# EAGLE design bike_tracker (EAGLE 9.2.1)
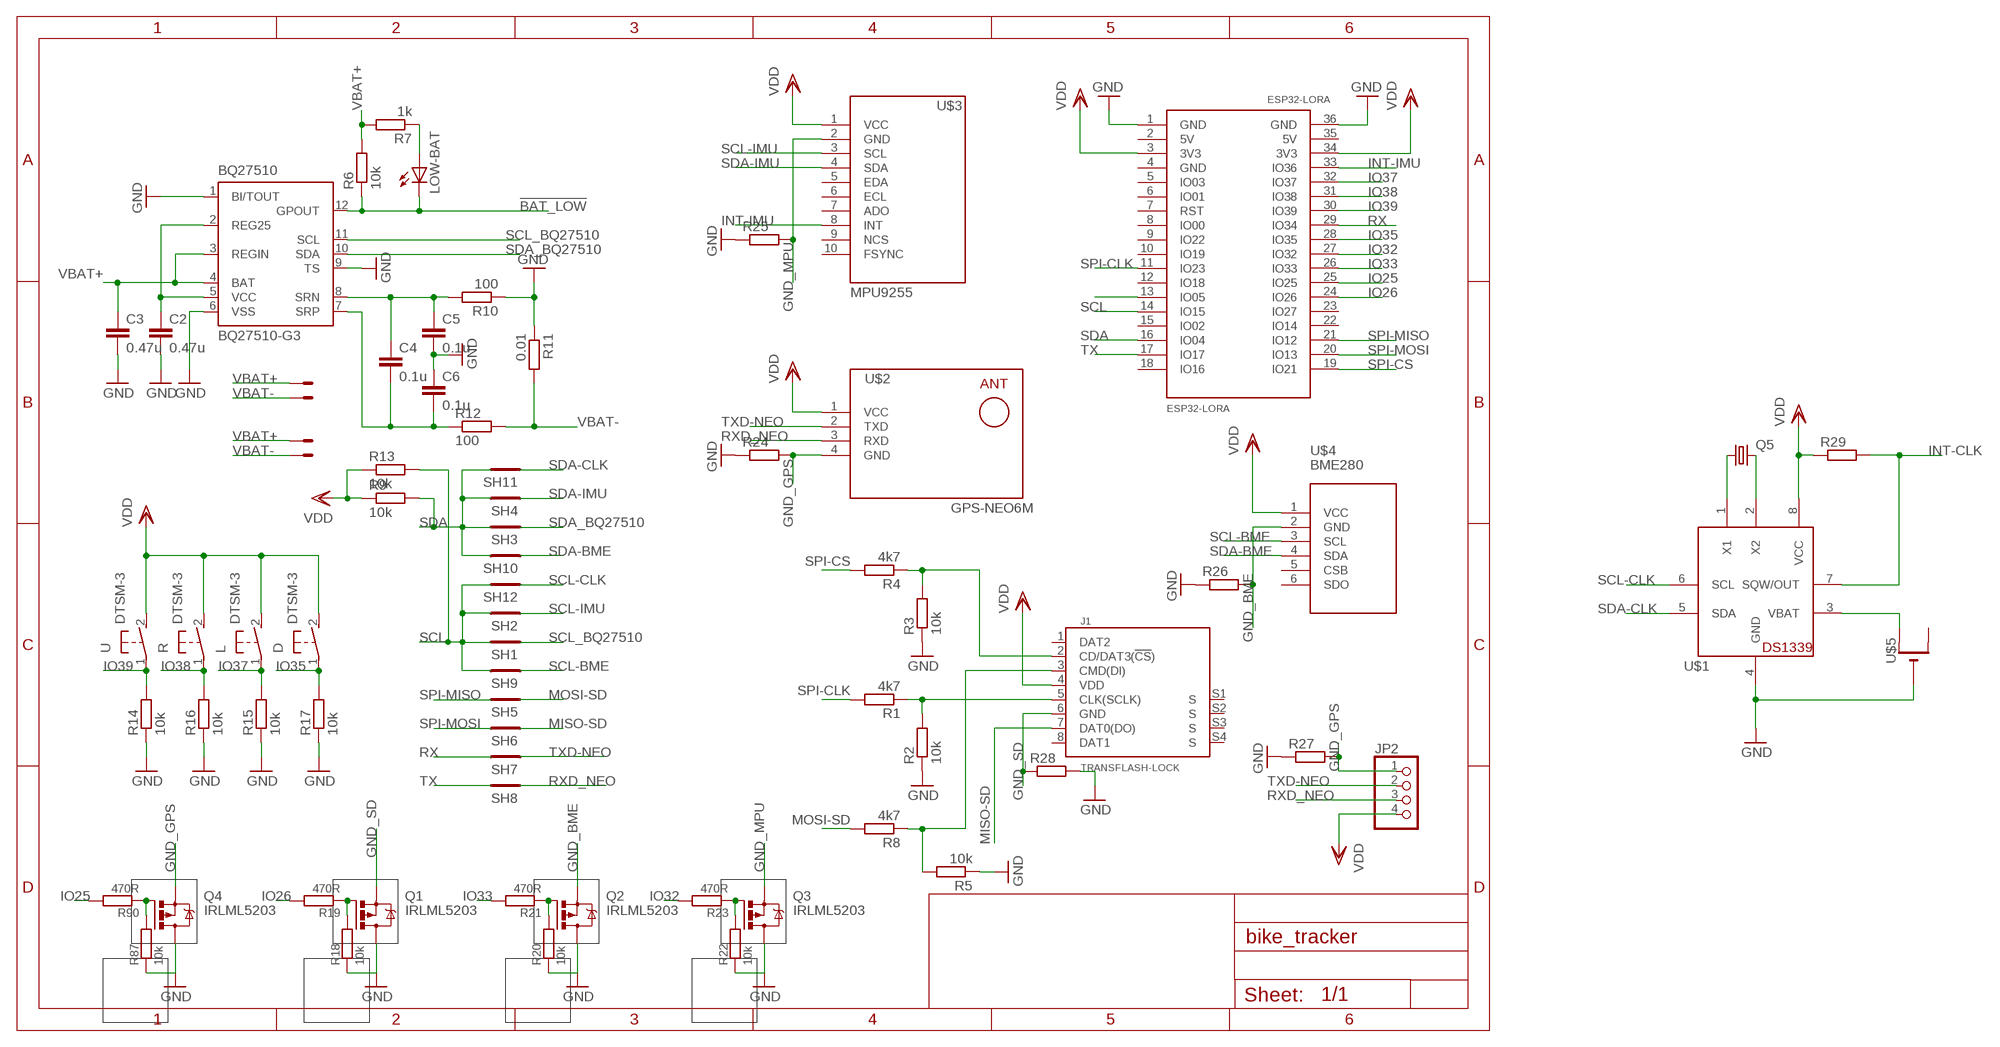
[diagram p0: schematic, sheet 1]

## Parts
BAT  332-02  [332-02]
BAT-IN  332-02  [332-02]
BQ27510  BQ27510-G3  [DRZ]
C2  0.47u  C-EUC0603  [C0603]
C3  0.47u  C-EUC0603  [C0603]
C4  0.1u  C-EUC0603  [C0603]
C5  0.1u  C-EUC0603  [C0603]
C6  0.1u  C-EUC0603  [C0603]
D  DTSM-3  [DTSM-3]
ESP32-LORA  ESP32LORA  [ESP32-LORA-TTGO]
J1  TRANSFLASH-LOCK  [TRANSFLASH-LOCK-SOCK]
JP2  PINHD-1X4  [1X04]
L  DTSM-3  [DTSM-3]
LOW-BAT  LEDSML0805  [SML0805]
Q1  IRLML5203  [MICRO3]
Q2  IRLML5203  [MICRO3]
Q3  IRLML5203  [MICRO3]
Q4  IRLML5203  [MICRO3]
Q5  CRYSTALTC26H  [TC26H]
R  DTSM-3  [DTSM-3]
R1  4k7  R-EU_R0603  [R0603]
R2  10k  R-EU_R0603  [R0603]
R3  10k  R-EU_R0603  [R0603]
R4  4k7  R-EU_R0603  [R0603]
R5  10k  R-EU_R0603  [R0603]
R6  10k  R-EU_R0603  [R0603]
R7  1k  R-EU_R0603  [R0603]
R8  4k7  R-EU_R0603  [R0603]
R9  10k  R-EU_R0603  [R0603]
R10  100  R-EU_R0603  [R0603]
R11  0.01  R-EU_R0603  [R0603]
R12  100  R-EU_R0603  [R0603]
R13  10k  R-EU_R0603  [R0603]
R14  10k  R-EU_R0603  [R0603]
R15  10k  R-EU_R0603  [R0603]
R16  10k  R-EU_R0603  [R0603]
R17  10k  R-EU_R0603  [R0603]
R18  10k  R_SMDR0603  [0603]
R19  470R  R_SMDR0603  [0603]
R20  10k  R_SMDR0603  [0603]
R21  470R  R_SMDR0603  [0603]
R22  10k  R_SMDR0603  [0603]
R23  470R  R_SMDR0603  [0603]
R24  R-EU_R0201  [R0201]
R25  R-EU_R0201  [R0201]
R26  R-EU_R0201  [R0201]
R27  R-EU_R0201  [R0201]
R28  R-EU_R0201  [R0201]
R29  R-EU_R0603  [R0603]
R87  10k  R_SMDR0603  [0603]
R90  470R  R_SMDR0603  [0603]
SH1  SHORT  [SHORT_TOP-20]
SH2  SHORT  [SHORT_TOP-20]
SH3  SHORT  [SHORT_TOP-20]
SH4  SHORT  [SHORT_TOP-20]
SH5  SHORT  [SHORT_TOP-20]
SH6  SHORT  [SHORT_TOP-20]
SH7  SHORT  [SHORT_TOP-20]
SH8  SHORT  [SHORT_TOP-20]
SH9  SHORT  [SHORT_TOP-20]
SH10  SHORT  [SHORT_TOP-20]
SH11  SHORT  [SHORT_TOP-20]
SH12  SHORT  [SHORT_TOP-20]
U  DTSM-3  [DTSM-3]
U$1  DS1339  [SOPM08]
U$2  GPS-NEO6M  [GPS-RECEIVER-NEO6M2]
U$3  MPU9255  [MPU9255]
U$4  BME280  [BME280]
U$5  CR1220SMT  [CR1220-SMD]

## Nets
!BAT_LOW: BQ27510.12(GPOUT) LOW-BAT.C R6.1
GND [Ground]: BQ27510.1(BI/TOUT) BQ27510.6(VSS) BQ27510.9(TS) C2.2 C3.2 C5.2 C6.1 ESP32-LORA.1(GND) ESP32-LORA.36(GND) Q1.3(D) Q2.3(D) Q3.3(D) Q4.3(D) R2.1 R3.1 R5.1 R10.1 R11.1 R14.1 R15.1 R16.1 R17.1 R18.1 R20.1 R22.1 R24.1 R25.1 R26.1 R27.1 R28.2 R87.1 U$1.4(GND) U$5.-
GND_BME [Ground]: Q2.2(S) R26.2 U$4.2(GND)
GND_GPS [Ground]: JP2.1 Q4.2(S) R24.2 R27.2 U$2.4(GND)
GND_MPU [Ground]: Q3.2(S) R25.2 U$3.2(GND)
GND_SD [Ground]: J1.6(GND) Q1.2(S) R28.1
INT-CLK: R29.2 U$1.7(SQW/OUT)
INT-IMU: ESP32-LORA.33(IO36) U$3.8(INT)
IO25: ESP32-LORA.25(IO25) R90.2
IO26: ESP32-LORA.24(IO26) R19.2
IO32: ESP32-LORA.27(IO32) R23.2
IO33: ESP32-LORA.26(IO33) R21.2
IO35: D.1 ESP32-LORA.28(IO35) R17.2
IO37: ESP32-LORA.32(IO37) L.1 R15.2
IO38: ESP32-LORA.31(IO38) R16.2 R.1
IO39: ESP32-LORA.30(IO39) R14.2 U.1
MISO-SD: J1.7(DAT0(DO)) SH6.1
MOSI-SD: R8.2 SH5.1
N$1: J1.5(CLK(SCLK)) R1.1 R2.2
N$2: J1.2(CD/DAT3(!CS!)) R3.2 R4.1
N$3: J1.3(CMD(DI)) R5.2 R8.1
N$4: Q4.1(G) R87.2 R90.1
N$5: Q1.1(G) R18.2 R19.1
N$6: Q2.1(G) R20.2 R21.1
N$7: BQ27510.2(REG25) BQ27510.5(VCC) C2.1
N$8: Q3.1(G) R22.2 R23.1
N$9: LOW-BAT.A R7.1
N$10: Q5.1 U$1.1(X1)
N$11: BQ27510.8(SRN) C4.1 C5.1 R10.2
N$12: ESP32-LORA.13(IO05)
N$13: Q5.2 U$1.2(X2)
N$14: BQ27510.7(SRP) C4.2 C6.2 R12.1
N$15: U$1.3(VBAT) U$5.+$1(+)
RX: ESP32-LORA.29(IO34) SH7.2
RXD_NEO: JP2.3 SH8.1 U$2.3(RXD)
SCL: ESP32-LORA.14(IO15) R13.2 SH1.2 SH2.2 SH9.2 SH12.2
SCL-BME: SH9.1 U$4.3(SCL)
SCL-CLK: SH12.1 U$1.6(SCL)
SCL-IMU: SH2.1 U$3.3(SCL)
SCL_BQ27510: BQ27510.11(SCL) SH1.1
SDA: ESP32-LORA.16(IO04) R9.2 SH3.2 SH4.2 SH10.2 SH11.2
SDA-BME: SH10.1 U$4.4(SDA)
SDA-CLK: SH11.1 U$1.5(SDA)
SDA-IMU: SH4.1 U$3.4(SDA)
SDA_BQ27510: BQ27510.10(SDA) SH3.1
SPI-CLK: ESP32-LORA.11(IO23) R1.2
SPI-CS: ESP32-LORA.19(IO21) R4.2
SPI-MISO: ESP32-LORA.21(IO12) SH5.2
SPI-MOSI: ESP32-LORA.20(IO13) SH6.2
TX: ESP32-LORA.17(IO17) SH8.2
TXD-NEO: JP2.2 SH7.1 U$2.2(TXD)
VBAT+: BAT-IN.2 BAT.1 BQ27510.3(REGIN) BQ27510.4(BAT) C3.1 R6.2 R7.2
VBAT-: BAT-IN.1 BAT.2 R11.2 R12.2
VDD: D.2 ESP32-LORA.3(3V3) ESP32-LORA.34(3V3) J1.4(VDD) JP2.4 L.2 R9.1 R13.1 R29.1 R.2 U$1.8(VCC) U$2.1(VCC) U$3.1(VCC) U$4.1(VCC) U.2
Unconnected: ESP32-LORA.5(IO03) ESP32-LORA.6(IO01) ESP32-LORA.7(RST) ESP32-LORA.8(IO00) ESP32-LORA.9(IO22) ESP32-LORA.10(IO19) ESP32-LORA.12(IO18) ESP32-LORA.15(IO02) ESP32-LORA.18(IO16) ESP32-LORA.22(IO14) ESP32-LORA.23(IO27) J1.1(DAT2) J1.8(DAT1) J1.S1(S) J1.S2(S) J1.S3(S) J1.S4(S) U$3.5(EDA) U$3.6(ECL) U$3.7(ADO) U$3.9(NCS) U$3.10(FSYNC) U$4.5(CSB) U$4.6(SDO) U$5.+$2(+1)

## Power pins joined to a net without a drawn wire
5V: ESP32-LORA.2(5V) ESP32-LORA.35(5V)
GND: ESP32-LORA.4(GND)
PWPD: BQ27510.EXP@1(PWPD) BQ27510.EXP@2(PWPD) BQ27510.EXP@3(PWPD) BQ27510.EXP@4(PWPD) BQ27510.EXP@5(PWPD) BQ27510.EXP@6(PWPD) BQ27510.EXP@7(PWPD) BQ27510.EXP@8(PWPD) BQ27510.EXP@9(PWPD)

## Library data of the parts
BAT BAT-IN = con-garry:332-02: 2 Pin - 2mm Dual Row Source: www.mpe-connector.de / garry_shortform_2012.pdf
BQ27510 = texas:BQ27510-G3
C2-C6 = rcl:C-EU: CAPACITOR, European symbol
D L R U = switch-tact:DTSM-3
ESP32-LORA = ESP32-DEVKITC:ESP32LORA
J1 = sd-mmc:TRANSFLASH: TransFlash TF Micro SD Card Socket Adapter
JP2 = pinhead:PINHD-1X4: PIN HEADER
LOW-BAT = led:LED: LED OSRAM: - CHIPLED LG R971, LG N971, LY N971, LG Q971, LY Q971, LO R971, LY R971 LH N974, LH R974 LS Q976, LO Q976, LY Q976 LO Q996 - Hyper CHIPLED LW Q18S LB Q993, LB Q99A, LB R99A - SideLED LS A670, LO A670, LY A670, LG A670, LP A670 LB A673, LV A673, LT A673, LW A673 LH A674 LY A675 LS A676, LA A676, LO A676, LY A676, LW A676 LS A679, LY A679, LG A679 - Hyper Micro SIDELED® LS Y876, LA Y876, LO Y876, LY Y876 LT Y87S - SmartLED LW L88C, LW L88S LB L89C, LB L89S, LG L890 LS L89K, LO L89K, LY L89K LS L896, LA L896, LO L896, LY L896 - TOPLED LS T670, LO T670, LY T670, LG T670, LP T670 LSG T670, LSP T670, LSY T670, LOP T670, LYG T670 LG T671, LOG T671, LSG T671 LB T673, LV T673, LT T673, LW T673 LH T674 LS T676, LA T676, LO T676, LY T676, LB T676, LH T676, LSB T676, LW T676 LB T67C, LV T67C, LT T67C, LS T67K, LO T67K, LY T67K, LW E67C LS E67B, LA E67B, LO E67B, LY E67B, LB E67C, LV E67C, LT E67C LW T67C LS T679, LY T679, LG T679 LS T770, LO T770, LY T770, LG T770, LP T770 LB T773, LV T773, LT T773, LW T773 LH T774 LS E675, LA E675, LY E675, LS T675 LS T776, LA T776, LO T776, LY T776, LB T776 LHGB T686 LT T68C, LB T68C - Hyper Mini TOPLED® LB M676 - Mini TOPLED Santana® LG M470 LS M47K, LO M47K, LY M47K Source: http://www.osram.convergy.de LUXEON: - LUMILED® LXK2-PW12-R00, LXK2-PW12-S00, LXK2-PW14-U00, LXK2-PW14-V00 LXK2-PM12-R00, LXK2-PM12-S00, LXK2-PM14-U00 LXK2-PE12-Q00, LXK2-PE12-R00, LXK2-PE12-S00, LXK2-PE14-T00, LXK2-PE14-U00 LXK2-PB12-K00, LXK2-PB12-L00, LXK2-PB12-M00, LXK2-PB14-N00, LXK2-PB14-P00, LXK2-PB14-Q00 LXK2-PR12-L00, LXK2-PR12-M00, LXK2-PR14-Q00, LXK2-PR14-R00 LXK2-PD12-Q00, LXK2-PD12-R00, LXK2-PD12-S00 LXK2-PH12-R00, LXK2-PH12-S00 LXK2-PL12-P00, LXK2-PL12-Q00, LXK2-PL12-R00 Source: www.luxeon.com KINGBRIGHT: KA-3528ASYC Source: www.kingbright.com
Q1-Q4 = transistor-power:IRLML5203: HEXFET P-Channel Power MOSFET
Q5 = adafruit:CRYSTAL: CRYSTAL; OC_FARNELL: unknown; OC_NEWARK: unknown
R1-R17 R24-R29 = resistor:R-EU_: RESISTOR, European symbol
R18-R23 R87 R90 = ssmd:R_SMD
SH1-SH12 = shorts:SHORT: Short between two nets
U$1 = adafruit:DS1339
U$2 = diy-modules:GPS-NEO6M
U$3 = diy-modules:MPU9255
U$4 = diy-modules:BME280
U$5 = adafruit:CR1220: CR1216/CR1220/CR1225 12mm 3V lithium coin cell Great for battery packup. Both SMT and THM holders. Note the THM package has the ground pads on both sides of the PCB so that the masks are the same - this reduces the cost

## Net classes
0 default: width 0.254 mm
1 Ground: width 0.1 mm, drill 0.2 mm

## Board
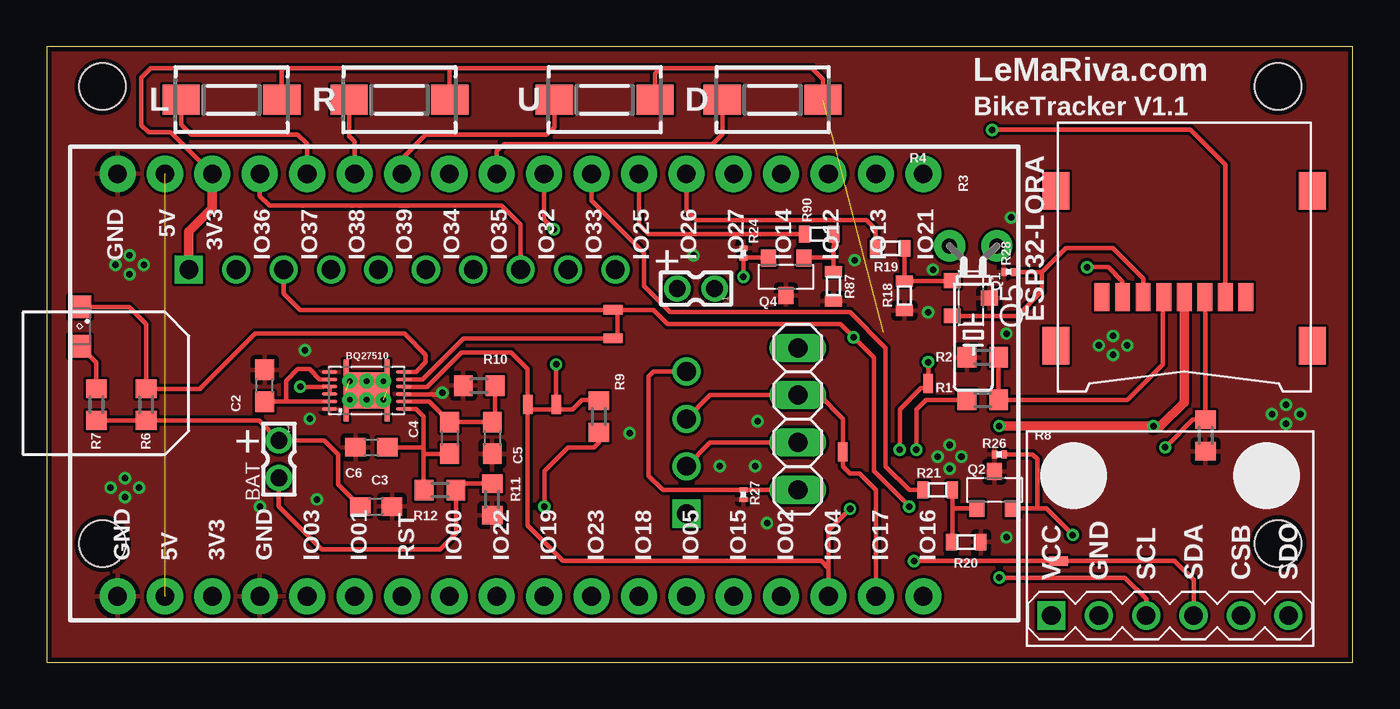
[diagram p1: board, top side]
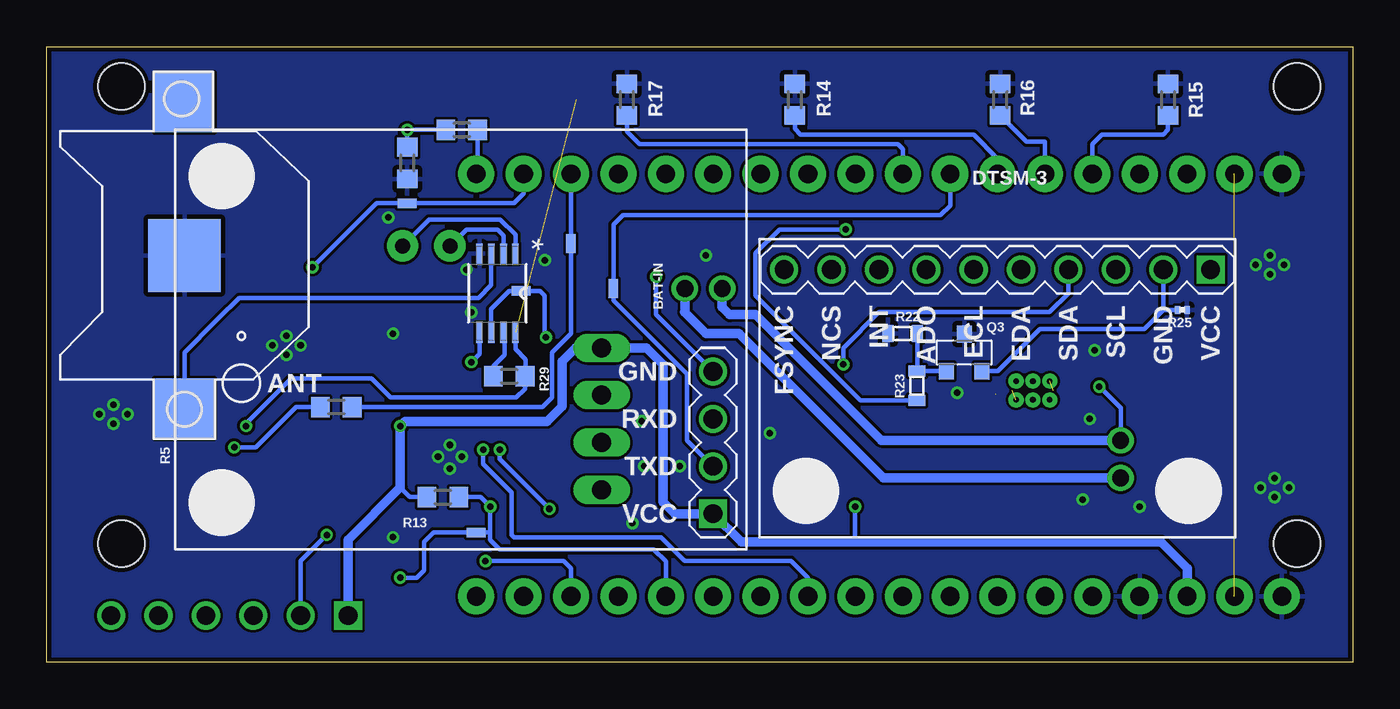
[diagram p2: board, bottom side, seen from below]

Size 70 x 33 mm. Coordinates in mm from the lower left corner, seen from the top.
Outline: 0,0 70,0 70,33 0,33 0,0
Copper layers (1*16): Top 0.035mm / dielectric 1.5mm / Bottom 0.035mm
Design rules "SeeedStudio_2layer_DRU_no_angle_20140221": minimum track width 6mil, minimum drill 12mil, track to track 6mil, track to pad 6mil, pad to pad 6mil, via to via 6mil, smd to smd 0mil, copper to edge 10mil, drill to drill 10mil, minimum pad ring 10mil, minimum via ring 6mil, stop-mask expansion 2mil, vias tented up to drill 100mil, thermal gap 10mil
Holes 2.5 mm at 3,30.85 66,6.35 3,6.35 66,30.85

### Footprints (pad centres in the part's own frame; a part is rotated, then mirrored left to right if it is on the bottom)
332-02 = drill 0.9 pad 1.27: 1 0,-1; 2 0,1
DRZ = smd 0.85 x 0.2: 1 -1.975,1; 2 -1.975,0.6; 3 -1.975,0.2; 4 -1.975,-0.2; 5 -1.975,-0.6; 6 -1.975,-1; 7 1.975,-1; 8 1.975,-0.6; 9 1.975,-0.2; 10 1.975,0.2; 11 1.975,0.6; 12 1.975,1 | smd 2.45 x 1.95: EXP@1 0,0 | smd 0.25 x 3.3: EXP@2 -1.1,0; EXP@3 1.1,0 | drill 0.3 pad 0.406: EXP@4 -0.9,0.5; EXP@5 0,0.5; EXP@6 0.9,0.5; EXP@7 -0.9,-0.5; EXP@8 0,-0.5; EXP@9 0.9,-0.5
C0603 = smd 1.1 x 1: 1 -0.85,0; 2 0.85,0
DTSM-3 = smd 2 x 1.6: 1 -2.7,0; 2 2.7,0
ESP32-LORA-TTGO = drill 1 pad 1.93: 1 -21.6,-11.42; 2 -19.06,-11.42; 3 -16.52,-11.42; 4 -13.98,-11.42; 5 -11.44,-11.42; 6 -8.9,-11.42; 7 -6.36,-11.42; 8 -3.82,-11.42; 9 -1.28,-11.42; 10 1.26,-11.42; 11 3.8,-11.42; 12 6.34,-11.42; 13 8.88,-11.42; 14 11.42,-11.42; 15 13.96,-11.42; 16 16.5,-11.42; 17 19.04,-11.42; 18 21.58,-11.42; 19 21.58,11.23; 20 19.04,11.23; 21 16.5,11.23; 22 13.96,11.23; 23 11.42,11.23; 24 8.88,11.23; 25 6.34,11.23; 26 3.8,11.23; 27 1.26,11.23; 28 -1.28,11.23; 29 -3.82,11.23; 30 -6.36,11.23; 31 -8.9,11.23; 32 -11.44,11.23; 33 -13.98,11.23; 34 -16.52,11.23; 35 -19.06,11.23; 36 -21.6,11.23
TRANSFLASH-LOCK-SOCK = smd 0.8 x 1.5: 1 3.3,-0.46; 2 2.2,-0.46; 3 1.1,-0.46; 4 0,-0.46; 5 -1.1,-0.46; 6 -2.2,-0.46; 7 -3.3,-0.46; 8 -4.4,-0.46 | smd 1.45 x 2: S1 -6.875,-3.06; S2 -6.875,5.24; S3 6.875,5.24; S4 6.875,-3.06
1X04 = drill 1.016 long: 1 -3.81,0; 2 -1.27,0; 3 1.27,0; 4 3.81,0
SML0805 = smd 1.2 x 1.2: A 1.05,0; C -1.05,0
MICRO3 = smd 0.8 x 0.9: 1 -0.95,-1; 2 0.95,-1; 3 0,1
TC26H = drill 0.813 pad 1.676: 1 -1.27,0; 2 1.27,0
R0603 = smd 1 x 1.1: 1 -0.85,0; 2 0.85,0
0603 = smd 0.6 x 0.9: 1 -0.787,0; 2 0.787,0
R0201 = smd 0.28 x 0.43: 1 -0.255,0; 2 0.255,0
SHORT_TOP-20 = smd 0.508 x 0.508: 1 0.381,0; 2 -0.127,0
SOPM08 = smd 1.067 x 0.356: 1 -2.134,0.965; 2 -2.134,0.33; 3 -2.134,-0.33; 4 -2.134,-0.965; 5 2.134,-0.965; 6 2.134,-0.33; 7 2.134,0.33; 8 2.134,0.965
GPS-RECEIVER-NEO6M2 = drill 1 square: 1 -14.605,10.16 | drill 1: 2 -14.605,7.62; 3 -14.605,5.08; 4 -14.605,2.54
MPU9255 = drill 1 square: 1 -8.001,10.16 | drill 1: 2 -8.001,7.62; 3 -8.001,5.08; 4 -8.001,2.54; 5 -8.001,0; 6 -8.001,-2.54; 7 -8.001,-5.08; 8 -8.001,-7.62; 9 -8.001,-10.16; 10 -8.001,-12.7
BME280 = drill 1 square: 1 -8.001,10.16 | drill 1: 2 -8.001,7.62; 3 -8.001,5.08; 4 -8.001,2.54; 5 -8.001,0; 6 -8.001,-2.54
CR1220-SMD = smd 3.2 x 3.2: +$1 -8.2,0; +$2 8.2,0 | smd 3.9 x 3.9: - 0,0

### Placement (x,y rotation side)
BAT  12.45,10.89 180 top
BAT-IN  34.8,20.03 90 top
BQ27510  17.15,14.57 0 top
C2  11.68,14.82 90 top
C3  17.65,8.35 0 top
C4  21.59,12.03 270 top
C5  23.88,12.03 270 top
C6  17.4,11.52 0 top
D  38.91,30.15 0 top
ESP32-LORA  25.4,14.95 0 top
J1  60.96,20.03 0 top
JP2  40.26,13.04 90 top
L  9.91,30.15 0 top
LOW-BAT  1.78,18 270 top
Q1  49.53,19.52 270 top
Q2  50.8,9.23 0 top
Q3  20.83,16.6 0 bottom
Q4  39.62,20.66 180 top
Q5  49.66,22.32 180 top
R  18.91,30.15 0 top
R1  50.16,14.06 180 top
R2  50.16,16.35 0 top
R3  50.67,26.76 90 bottom
R4  47.75,28.54 0 bottom
R5  62.1,12.16 90 top
R6  5.33,13.81 270 top
R7  2.67,13.81 270 top
R8  54.48,13.68 0 bottom
R9  29.59,13.17 90 top
R10  23.18,14.82 0 top
R11  23.88,8.73 90 top
R12  21.08,9.23 0 top
R13  48.77,8.85 0 bottom
R14  29.91,30.15 270 bottom
R15  9.91,30.15 270 bottom
R16  18.9,30.15 270 bottom
R17  38.91,30.15 270 bottom
R18  45.97,19.65 90 top
R19  45.21,22.19 180 top
R20  49.28,6.44 180 top
R21  47.75,9.23 180 top
R22  24.13,17.62 0 bottom
R23  23.37,14.82 270 bottom
R24  37.34,21.94 270 top
R25  9.14,18.89 180 bottom
R26  51.05,11.14 0 top
R27  37.34,8.98 90 top
R28  51.56,20.92 180 top
R29  45.21,15.33 180 bottom
R87  42.16,20.16 90 top
R90  41.4,22.95 180 top
SH1  30.48,17.36 180 top
SH2  30.48,18.89 180 top
SH3  25.78,13.68 90 top
SH4  27.3,13.68 90 top
SH5  41.91,22.57 270 bottom
SH6  50.55,24.6 180 bottom
SH7  39.62,20.16 270 bottom
SH8  42.67,11.14 90 top
SH9  46.86,6.95 180 bottom
SH10  54.1,5.42 0 top
SH11  47.24,14.82 90 top
SH12  44.45,19.9 180 bottom
U  29.91,30.15 0 top
U$1  45.85,19.78 270 bottom
U$2  48.89,18.12 180 bottom
U$3  17.78,13.04 270 bottom
U$4  64.01,10.5 90 top
U$5  62.61,21.81 90 bottom

### Tracks (layer width: path | path; a pad name or v marks a point on that pad's centre or on a via)
5V  (1 unrouted)
!BAT_LOW
  Top 0.254: 8.26,14.7 11.05,17.49 11.18,17.62 19.18,17.62 20.32,16.47 20.32,16.09 19.8,15.57 BQ27510.12 | 8.26,14.7 8.22,14.66 | 8.26,14.7 8.22,14.66 | 8.22,14.66 R6.1 5.33,18.12 4.41,19.05 LOW-BAT.C
GND  (via drill 0.35)  (1 unrouted)
  Top 0.254: BQ27510.9 21.12,14.36 v21.21,14.44
  other vias: 4.45,20.79 4.45,21.81 5.21,21.3 3.68,21.3 4.19,8.85 4.19,9.87 4.95,9.36 3.43,9.36 31.24,12.28 48.39,10.38 48.39,11.65 49.02,11.01 47.75,11.01 13.84,16.73 14.1,13.04 14.48,8.73 11.43,8.35 66.42,12.79 66.42,13.81 67.18,13.3 65.66,13.3 38.1,12.92 37.97,10.5 36.07,10.5 34.67,21.81 47.5,21.05 57.15,16.47 57.15,17.49 57.91,16.98 56.39,16.98 51.43,6.7 51.69,23.84 51.43,17.62 47.24,18.76 43.31,21.55 38.61,7.46
  pour Top: 0,33.03 69.72,33.03 69.72,0 0,0
  pour Bottom: 0,33.03 69.72,33.03 69.72,0 0,0
GND_BME  (via drill 0.35)
  Top 0.254: v54.99,6.82 53.58,8.23 53.09,8.23 | 53.09,8.23 Q2.2 | 53.09,8.23 53.09,10.89 52.83,11.14 R26.2
  Bottom 0.254: v54.99,6.82 56.39,5.42 U$4.2
GND_GPS  (via drill 0.35)
  Top 0.254: U$2.4 32.51,15.58 32.26,15.33 32.26,10 33.02,9.23 R27.2 JP2.1 | v37.34,20.66 R24.2 38.66,21.68 Q4.2
  Bottom 0.254: v37.34,20.66 37.34,18.63 U$2.4
GND_MPU
  Bottom 0.254: 10.16,18.89 11.18,17.87 16.76,17.87 19.03,15.6 Q3.2 | 10.16,18.89 U$3.2 | R25.2 10.16,18.89
GND_SD
  Top 0.254: J1.6 58.76,20.58 57.15,22.19 54.61,22.19 53.34,20.92 | 53.34,20.92 53.34,19.9 52.01,18.57 Q1.2 | 53.34,20.92 R28.1
INT-CLK
  Bottom 0.254: R29.2 46.06,15.88 45.47,16.47 45.47,17.59 U$1.7
INT-IMU
  Top 0.254: ESP32-LORA.33 11.42,24.99 11.94,24.48 24.38,24.48 25.4,23.46 U$3.8
IO25
  Top 0.254: ESP32-LORA.25 31.74,23.47 32.26,22.95 R90.2
IO26
  Top 0.254: R19.2 44.42,23.18 44.45,23.2 43.94,23.71 34.8,23.71 34.28,24.23 ESP32-LORA.24
IO32  (via drill 0.35)
  Top 0.254: v27.18,23.2 26.66,23.72 ESP32-LORA.27
  Bottom 0.254: R23.2 26.39,14.04 32,19.65 32,21.93 30.73,23.2 v27.18,23.2
IO33
  Top 0.254: R21.2 46.23,9.23 44.96,10.5 44.96,16.85 43.05,18.76 33.4,18.76 32,20.16 32,21.93 29.2,24.74 ESP32-LORA.26
IO35
  Top 0.254: D.1 36.21,28.3 35.69,27.78 24.51,27.78 24.12,27.39 ESP32-LORA.28
  Bottom 0.254: ESP32-LORA.28 24.12,27.51 24.38,27.78 38.23,27.78 38.91,28.46 R17.2
IO37
  Top 0.254: L.1 7.21,28.83 7.75,28.29 13.46,28.29 13.96,27.79 ESP32-LORA.32
  Bottom 0.254: R15.2 9.91,28.54 10.16,28.29 13.46,28.29 13.97,27.78 13.96,27.77 ESP32-LORA.32
IO38
  Top 0.254: R.1 16.21,28.21 16.51,27.9 ESP32-LORA.31
  Bottom 0.254: R16.2 17.49,27.9 16.51,27.9 16.5,27.89 ESP32-LORA.31
IO39
  Top 0.254: ESP32-LORA.30 19.04,27.01 20.32,28.29 26.8,28.29 27.21,28.69 U.1
  Bottom 0.254: R14.2 29.91,28.6 29.59,28.29 20.32,28.29 19.04,27.01 ESP32-LORA.30
MISO-SD  (via drill 0.35)
  Top 0.254: v55.75,21.17 56.9,21.17 57.66,20.41 J1.7
  Bottom 0.254: v55.75,21.17 52.32,24.6 SH6.1
MOSI-SD
  Bottom 0.254: SH5.1 41.91,17.62 42.93,16.6 42.93,14.19 43.43,13.68 R8.2
N$1
  Top 0.254: J1.5 59.82,19.53 59.82,15.97 57.91,14.06 R1.1 R2.2
N$2  (via drill 0.35)
  Top 0.254: v50.67,28.54 61.3,28.54 63.16,26.68 J1.2
  Bottom 0.254: R3.2 v50.67,28.54 R4.1
N$3  (via drill 0.35)
  Top 0.254: J1.3 62.1,19.53 R5.2 61.43,13.01 v59.94,11.52
  Bottom 0.254: R8.1 56.64,13.68 58.8,11.52 v59.94,11.52
N$4
  Top 0.254: R87.2 42.16,21.68 | 42.16,21.68 R90.1 | Q4.1 40.59,21.68 42.16,21.68
N$5
  Top 0.254: R19.1 45.97,22.16 R18.2 48.51,20.44 Q1.1
N$6
  Top 0.254: R20.2 48.54,6.49 48.54,8.22 | R21.1 48.54,8.22 | Q2.1 48.55,8.23 48.54,8.22
N$7
  Top 0.254: BQ27510.5 12.83,13.97 | 12.83,13.97 C2.1 | 12.83,13.97 12.83,15.08 13.46,15.71 14.1,15.71 14.64,15.17 BQ27510.2
N$8
  Bottom 0.254: Q3.1 23.36,15.6 R23.1 23.34,15.64 R22.2
N$9
  Top 0.254: LOW-BAT.A 2.67,16.06 R7.1
N$10
  Bottom 0.254: U$1.1 44.88,22.93 45.7,23.74 49.5,23.74 Q5.1
N$11
  Top 0.254: BQ27510.8 20.5,13.97 C4.1 C5.1 24.03,13.03 R10.2
N$13
  Bottom 0.254: Q5.2 47.5,23.2 45.85,23.2 45.52,22.87 U$1.2
N$14
  Top 0.254: BQ27510.7 19.8,13.57 20.19,13.17 20.19,11.52 | 20.19,11.52 20.19,11.14 | 20.19,11.14 20.19,9.27 R12.1 | C4.2 20.23,11.18 20.19,11.14 | 20.19,11.52 C6.2
N$15
  Bottom 0.254: U$1.3 46.18,20.21 46.86,19.52 59.69,19.52 60.77,18.44 60.96,18.25 62.61,16.6 U$5.+$1 63.37,14.37
PWPD  (2 unrouted)
  Top 0.254: BQ27510.EXP@1 BQ27510.EXP@5 | BQ27510.EXP@1 16.65,15.07 BQ27510.EXP@4 | BQ27510.EXP@1 16.74,14.57 BQ27510.EXP@7 | BQ27510.EXP@1 BQ27510.EXP@8 | BQ27510.EXP@1 17.65,14.07 BQ27510.EXP@9 | BQ27510.EXP@1 17.55,14.57 BQ27510.EXP@6
RX
  Bottom 0.254: ESP32-LORA.29 21.58,24.48 22.1,23.97 39.12,23.97 39.62,23.46 SH7.2
RXD_NEO
  Top 0.254: U$2.3 35.56,14.31 JP2.3 41.4,14.31 42.67,13.04 SH8.1
SCL  (via drill 0.35)
  Top 0.254: v46.23,8.35 44.32,10.25 44.32,16.35 v43.24,17.43 42.55,18.12 33.27,18.12 32.51,18.89 SH2.2 SH1.2
  Bottom 0.254: ESP32-LORA.14 36.82,5.41 37.46,6.06 45.72,6.06 46.23,6.57 46.23,6.95 | 46.23,6.95 v46.23,8.35 46.74,8.85 R13.2 | v43.24,17.43 43.31,17.49 43.31,19.65 43.56,19.9 SH12.2 | SH9.2 46.23,6.95
SCL-BME  (via drill 0.35)
  Top 0.254: U$4.3 58.93,3.39 57.79,4.54 v51.05,4.54
  Bottom 0.254: SH9.1 49.28,6.95 49.78,6.44 49.78,4.92 50.16,4.54 v51.05,4.54
SCL-CLK
  Bottom 0.254: SH12.1 45.21,19.9 46.18,18.94 U$1.6
SCL-IMU
  Top 0.254: U$3.3 12.7,19.78 13.59,18.89 SH2.1
SCL_BQ27510
  Top 0.254: BQ27510.11 20.16,15.17 22.35,17.36 SH1.1
SDA  (via drill 0.35)
  Top 0.254: 41.91,5.04 41.53,5.42 27.69,5.42 25.78,7.33 SH3.2 SH4.2 28.19,13.55 28.7,14.06 29.55,14.06 R9.2 | 41.91,5.04 41.91,3.54 ESP32-LORA.16 | v45.72,11.39 45.72,13.55 46.86,14.7 SH11.2 | v43.05,8.22 41.91,7.08 41.91,5.04 | SH10.2 v46.48,5.42
  Bottom 0.254: v46.48,5.42 42.29,5.42 41.9,5.03 ESP32-LORA.16 | v45.72,11.39 45.72,10.89 v43.05,8.22
SDA-BME
  Top 0.254: U$4.4 61.47,4.41 60.51,5.36 60.45,5.42 SH10.1
SDA-CLK  (via drill 0.35)
  Top 0.254: SH11.1 v47.24,16.09
  Bottom 0.254: v47.24,16.09 46.81,16.52 U$1.5
SDA-IMU  (via drill 0.35)
  Top 0.254: SH4.1 v27.3,15.97
  Bottom 0.254: U$3.4 15.24,19.78 16.26,18.76 25.4,18.76 27.3,16.85 v27.3,15.97
SDA_BQ27510
  Top 0.254: BQ27510.10 20.39,14.76 22.23,16.6 24.89,16.6 25.78,15.71 SH3.1
SPI-CLK  (via drill 0.35)
  Top 0.254: R1.2 47.12,14.06 46.61,13.55 v46.61,11.39
  Bottom 0.254: v46.61,11.39 46.61,10.63 45.09,9.11 45.09,6.82 44.96,6.7 37.08,6.7 35.81,5.42 30.1,5.42 29.2,4.53 ESP32-LORA.11
SPI-CS
  Bottom 0.254: R4.2 46.9,26.26 ESP32-LORA.19
SPI-MISO
  Bottom 0.254: ESP32-LORA.21 41.9,23.21 SH5.2
SPI-MOSI
  Bottom 0.254: ESP32-LORA.20 44.44,25.12 44.96,24.6 SH6.2
TX
  Top 0.254: ESP32-LORA.17 44.45,3.54 44.45,9.23 43.56,10.12 43.05,10.12 42.67,10.5 SH8.2
TXD-NEO
  Top 0.254: JP2.2 35.56,11.77 U$2.2
  Bottom 0.254: U$2.2 35.69,11.9 35.69,15.46 39.62,19.4 SH7.1
VBAT+  (via drill 0.35)
  Top 0.254: BQ27510.4 BQ27510.3 14.81,14.77 14.81,14.76 13.6,14.76 v13.59,14.77 | R7.2 R6.2 11.38,12.96 BAT.1 14.84,11.89 14.86,11.9 15.62,11.14 15.62,9.53 C3.1
  Bottom 0.254: v13.59,14.77 12.45,13.63 BAT.1
  Bottom 0.508: BAT-IN.2 33.8,19.03 33.4,18.63 32,18.63 25.27,11.9 12.46,11.9
  Bottom 0.61: 12.46,11.9 BAT.1
VBAT-
  Top 0.254: BAT.2 12.45,8.35 14.73,6.06 21.08,6.06 21.93,6.91 R12.2 22.27,9.58 R11.2
  Bottom 0.508: BAT-IN.1 35.8,18.78 35.81,18.76 34.67,17.62 32.89,17.62 25.16,9.89 BAT.2
VDD  (via drill 0.35)  (1 unrouted)
  Top 0.254: v26.67,8.35 26.67,10.25 27.94,11.52 29.34,11.52 29.59,11.77 R9.1 | L.2 12.61,31.75 12.7,31.84 | 12.7,31.84 5.59,31.84 5.08,31.33 5.08,28.79 5.46,28.41 6.65,28.41 ESP32-LORA.34 | 12.7,31.84 21.59,31.84 | 21.59,31.84 32.89,31.84 | R.2 21.61,31.82 21.59,31.84 | U.2 32.61,31.55 32.89,31.84 | D.2 41.61,31.26 41.02,31.84 32.89,31.84
  Top 0.508: J1.4 60.96,13.93 59.69,12.66 v59.31,12.66 v51.05,12.66 | U$3.1 7.62,23.08 8.88,24.34 ESP32-LORA.34
  Bottom 0.254: v26.67,8.35 26.67,6.57 26.8,6.44 | R13.1 50.55,8.85 51.05,9.36 | 44.83,17.69 U$1.8 44.88,16.78 44.32,16.22 44.32,15.37 R29.1 44.36,14.66 44.83,14.19 51.56,14.19 52.58,15.2 56.9,15.2 59.31,12.79 v59.31,12.66
  Bottom 0.508: U$4.1 53.85,6.57 51.05,9.36 v51.05,12.66 50.8,12.92 43.18,12.92 42.39,13.7 42.39,16.12 41.66,16.85 JP2.4 | ESP32-LORA.3 8.88,5.03 10.29,6.44 26.8,6.44 32.77,6.44 U$2.1 36.32,7.96 36.96,8.6 36.96,15.97 37.85,16.85 JP2.4 | JP2.4 40.26,16.73

### Text on the board
tNames: LeMaRiva.com | BikeTracker V1.1 | + | +